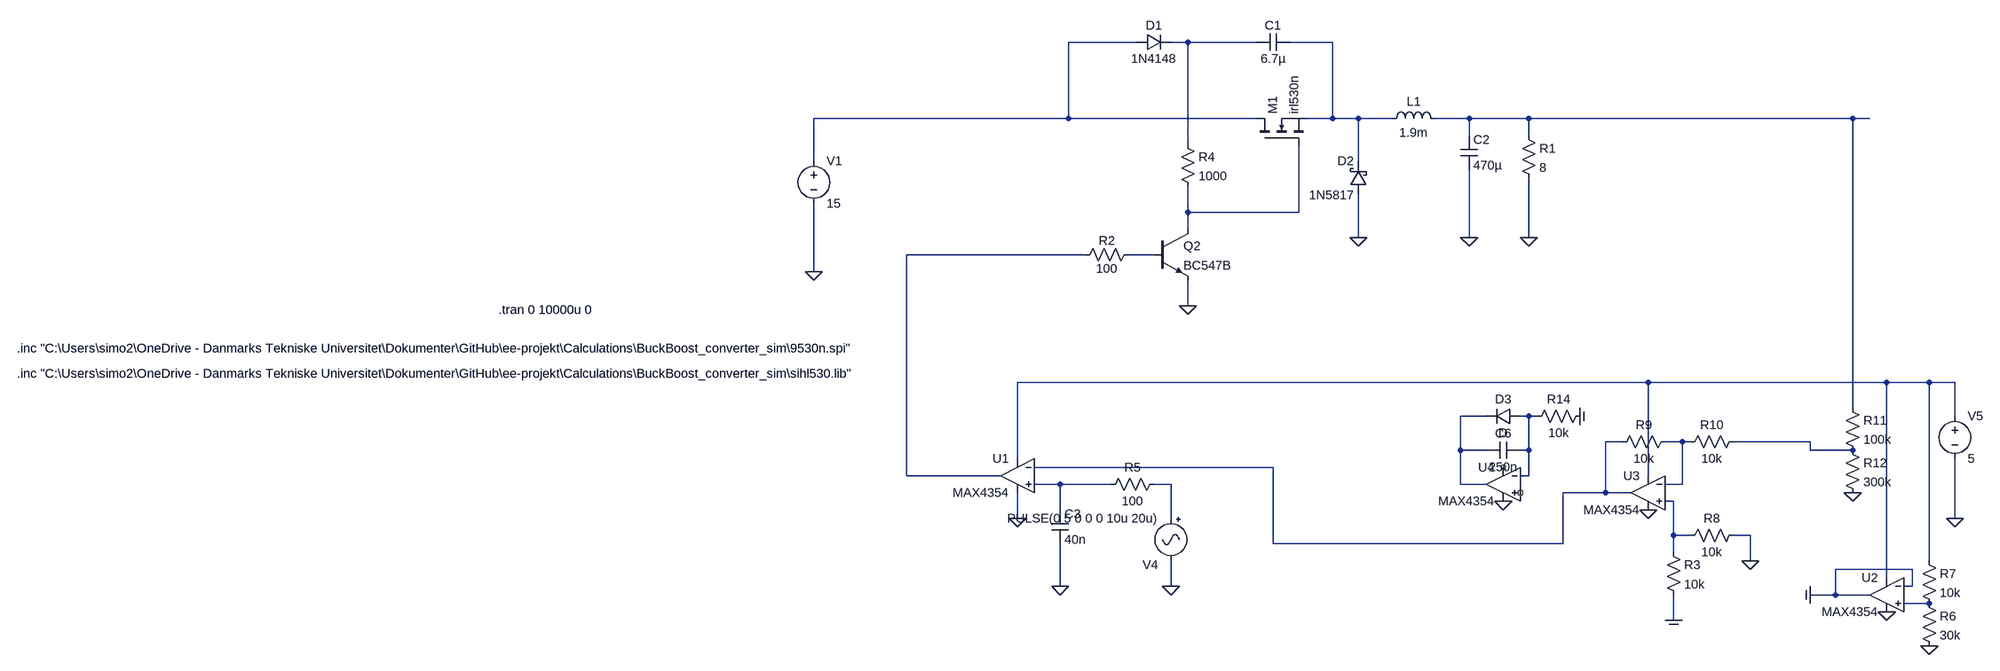
[diagram p0: schematic BuckBoost_P-Channel-v2switch_+analogkontrolv3.asc]
BuckBoost_P-Channel-v2switch_+analogkontrolv3.asc, the LTspice schematic file:
Version 4
SHEET 1 1808 1524
WIRE 112 16 -16 16
WIRE 208 16 176 16
WIRE 336 16 208 16
WIRE 480 16 400 16
WIRE -16 160 -16 16
WIRE -16 160 -496 160
WIRE 336 160 -16 160
WIRE 480 160 480 16
WIRE 480 160 432 160
WIRE 528 160 480 160
WIRE 592 160 528 160
WIRE 736 160 672 160
WIRE 848 160 736 160
WIRE 1456 160 848 160
WIRE 1488 160 1456 160
WIRE 736 192 736 160
WIRE 848 192 848 160
WIRE 208 208 208 16
WIRE -496 240 -496 160
WIRE 528 240 528 160
WIRE 208 336 208 288
WIRE 416 336 416 208
WIRE 416 336 208 336
WIRE 208 368 208 336
WIRE 528 384 528 304
WIRE 736 384 736 256
WIRE 848 384 848 272
WIRE 16 416 -320 416
WIRE 144 416 96 416
WIRE -496 448 -496 320
WIRE 208 512 208 464
WIRE 1072 656 -112 656
WIRE 1520 656 1072 656
WIRE 1600 656 1520 656
WIRE 1648 656 1600 656
WIRE 1456 704 1456 160
WIRE 768 720 720 720
WIRE 848 720 832 720
WIRE 864 720 848 720
WIRE 1648 720 1648 656
WIRE 1024 768 992 768
WIRE 1136 768 1104 768
WIRE 1152 768 1136 768
WIRE 1376 768 1232 768
WIRE 720 784 720 720
WIRE 768 784 720 784
WIRE 848 784 848 720
WIRE 848 784 832 784
WIRE 1376 784 1376 768
WIRE 1456 784 1376 784
WIRE -112 800 -112 656
WIRE 368 816 -80 816
WIRE -320 832 -320 416
WIRE -144 832 -320 832
WIRE 848 832 848 784
WIRE 848 832 832 832
WIRE 1072 832 1072 656
WIRE -32 848 -80 848
WIRE 64 848 -32 848
WIRE 176 848 144 848
WIRE 720 848 720 784
WIRE 768 848 720 848
WIRE 1136 848 1136 768
WIRE 1136 848 1104 848
WIRE 992 864 992 768
WIRE 992 864 912 864
WIRE 1040 864 992 864
WIRE 1120 880 1104 880
WIRE -32 896 -32 848
WIRE -112 912 -112 864
WIRE 176 912 176 848
WIRE 1648 912 1648 800
WIRE 1120 944 1120 880
WIRE 1152 944 1120 944
WIRE 1264 944 1232 944
WIRE 368 960 368 816
WIRE 912 960 912 864
WIRE 912 960 368 960
WIRE 1120 976 1120 944
WIRE 1264 992 1264 944
WIRE 1600 992 1600 656
WIRE 1568 1008 1424 1008
WIRE 1520 1024 1520 656
WIRE -32 1040 -32 960
WIRE 176 1040 176 992
WIRE 1568 1040 1568 1008
WIRE 1568 1040 1552 1040
WIRE 1424 1056 1424 1008
WIRE 1424 1056 1376 1056
WIRE 1488 1056 1424 1056
WIRE 1600 1072 1552 1072
WIRE 1120 1104 1120 1056
FLAG -496 448 0
FLAG 848 384 0
FLAG 208 512 0
FLAG 736 384 0
FLAG 176 1040 0
FLAG -32 1040 0
FLAG 1648 912 0
FLAG -112 912 0
FLAG 528 384 0
FLAG 1520 1088 0
FLAG 1600 1152 0
FLAG 1376 1056 COM
FLAG 800 880 0
FLAG 1072 896 0
FLAG 944 720 COM
FLAG 1120 1104 COM
FLAG 1264 992 0
FLAG 1456 864 0
SYMBOL voltage -496 224 R0
WINDOW 123 0 0 Left 0
WINDOW 39 0 0 Left 0
SYMATTR InstName V1
SYMATTR Value 15
SYMBOL res 832 176 R0
SYMATTR InstName R1
SYMATTR Value 8
SYMBOL res 112 400 R90
WINDOW 0 5 56 VBottom 2
WINDOW 3 27 56 VTop 2
SYMATTR InstName R2
SYMATTR Value 100
SYMBOL nmos 336 208 R270
SYMATTR InstName M1
SYMATTR Value irl530n
SYMATTR Prefix X
SYMBOL cap 400 0 R90
WINDOW 0 0 32 VBottom 2
WINDOW 3 32 32 VTop 2
SYMATTR InstName C1
SYMATTR Value 6.7µ
SYMBOL diode 112 32 R270
WINDOW 0 32 32 VTop 2
WINDOW 3 0 32 VBottom 2
SYMATTR InstName D1
SYMATTR Value 1N4148
SYMBOL npn 144 368 R0
SYMATTR InstName Q2
SYMATTR Value BC547B
SYMBOL res 192 192 R0
SYMATTR InstName R4
SYMATTR Value 1000
SYMBOL ind 576 176 R270
WINDOW 0 32 56 VTop 2
WINDOW 3 5 56 VBottom 2
SYMATTR InstName L1
SYMATTR Value 1.9m
SYMBOL cap 720 192 R0
SYMATTR InstName C2
SYMATTR Value 470µ
SYMBOL OpAmps\\MAX4354 -112 768 M0
SYMATTR InstName U1
SYMBOL Misc\\signal 176 896 M0
WINDOW 0 24 104 Left 2
WINDOW 3 24 16 Left 2
WINDOW 123 0 0 Left 0
WINDOW 39 0 0 Left 0
SYMATTR InstName V4
SYMATTR Value PULSE(0 5 0 0 0 10u 20u)
SYMBOL res 160 832 R90
WINDOW 0 0 56 VBottom 2
WINDOW 3 32 56 VTop 2
SYMATTR InstName R5
SYMATTR Value 100
SYMBOL cap -48 896 R0
SYMATTR InstName C3
SYMATTR Value 40n
SYMBOL voltage 1648 704 R0
WINDOW 123 0 0 Left 0
WINDOW 39 0 0 Left 0
SYMATTR InstName V5
SYMATTR Value 5
SYMBOL schottky 544 304 R180
WINDOW 0 24 64 Left 2
WINDOW 3 24 0 Left 2
SYMATTR InstName D2
SYMATTR Value 1N5817
SYMATTR Description Diode
SYMATTR Type diode
SYMBOL OpAmps\\MAX4354 1520 992 M0
SYMATTR InstName U2
SYMBOL res 1584 1056 R0
SYMATTR InstName R6
SYMATTR Value 30k
SYMBOL res 1584 976 R0
SYMATTR InstName R7
SYMATTR Value 10k
SYMBOL OpAmps\\MAX4354 1072 800 M0
SYMATTR InstName U3
SYMBOL res 1120 752 R90
WINDOW 0 0 56 VBottom 2
WINDOW 3 32 56 VTop 2
SYMATTR InstName R9
SYMATTR Value 10k
SYMBOL res 1136 784 R270
WINDOW 0 32 56 VTop 2
WINDOW 3 0 56 VBottom 2
SYMATTR InstName R10
SYMATTR Value 10k
SYMBOL res 960 704 R90
WINDOW 0 0 56 VBottom 2
WINDOW 3 32 56 VTop 2
SYMATTR InstName R14
SYMATTR Value 10k
SYMBOL OpAmps\\MAX4354 800 784 M0
SYMATTR InstName U4
SYMBOL cap 832 768 R90
WINDOW 0 0 32 VBottom 2
WINDOW 3 32 32 VTop 2
SYMATTR InstName C6
SYMATTR Value 250n
SYMBOL res 1104 960 R0
SYMATTR InstName R3
SYMATTR Value 10k
SYMBOL res 1248 928 R90
WINDOW 0 0 56 VBottom 2
WINDOW 3 32 56 VTop 2
SYMATTR InstName R8
SYMATTR Value 10k
SYMBOL diode 832 704 R90
WINDOW 0 0 32 VBottom 2
WINDOW 3 32 32 VTop 2
SYMATTR InstName D3
SYMBOL res 1440 688 R0
SYMATTR InstName R11
SYMATTR Value 100k
SYMBOL res 1440 768 R0
SYMATTR InstName R12
SYMATTR Value 300k
TEXT -1992 592 Left 2 !.inc "C:\\Users\\simo2\\OneDrive - Danmarks Tekniske Universitet\\Dokumenter\\GitHub\\ee-projekt\\Calculations\\BuckBoost_converter_sim\\9530n.spi"
TEXT -1088 520 Left 2 !.tran 0 10000u 0
TEXT -1992 640 Left 2 !.inc "C:\\Users\\simo2\\OneDrive - Danmarks Tekniske Universitet\\Dokumenter\\GitHub\\ee-projekt\\Calculations\\BuckBoost_converter_sim\\sihl530.lib"

The netlist it stands for:
* BuckBoost_P-Channel-v2switch_+analogkontrolv3.asc
V1 N001 0 15
R1 N004 0 8
R2 N007 N006 100
XM1 N001 N005 N003 irl530n  ; pins D G S
C1 N003 N002 6.7µ
D1 N001 N002 1N4148
Q2 N005 N007 0 0 BC547B
R4 N002 N005 1000
L1 N003 N004 1.9m
C2 N004 0 470µ
XU1 N014 N011 N008 0 N006 MAX4354  ; pins In+ In- V+ V- OUT
V4 N015 0 PULSE(0 5 0 0 0 10u 20u)
R5 N015 N014 100
C3 N014 0 40n
V5 N008 0 5
D2 0 N003 1N5817
XU2 N017 COM N008 0 COM MAX4354  ; pins In+ In- V+ V- OUT
R6 N017 0 30k
R7 N008 N017 10k
XU3 N016 N012 N008 0 N011 MAX4354  ; pins In+ In- V+ V- OUT
R9 N012 N011 10k
R10 N012 N013 10k
R14 COM N010 10k
XU4 NC_01 N010 NC_02 0 N009 MAX4354  ; pins In+ In- V+ V- OUT
C6 N010 N009 250n
R3 N016 COM 10k
R8 0 N016 10k
D3 N010 N009 D
R11 N004 N013 100k
R12 N013 0 300k
.model D D
.lib standard.dio
.model NPN NPN
.model PNP PNP
.lib standard.bjt
.inc "C:\Users\simo2\OneDrive - Danmarks Tekniske Universitet\Dokumenter\GitHub\ee-projekt\Calculations\BuckBoost_converter_sim\9530n.spi"
.tran 0 10000u 0
.inc "C:\Users\simo2\OneDrive - Danmarks Tekniske Universitet\Dokumenter\GitHub\ee-projekt\Calculations\BuckBoost_converter_sim\sihl530.lib"
.lib MAX4354.lib
.backanno
.end